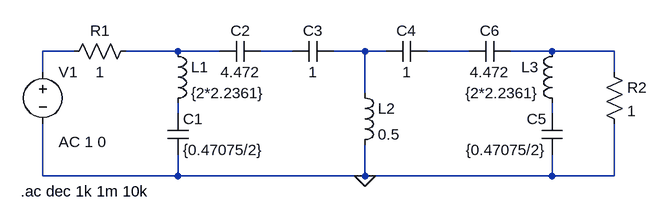
[diagram p0: schematic ej8.asc]
ej8.asc, the LTspice schematic file:
Version 4
SHEET 1 968 680
WIRE 80 80 32 80
WIRE 240 80 160 80
WIRE 304 80 240 80
WIRE 416 80 368 80
WIRE 528 80 480 80
WIRE 560 80 528 80
WIRE 688 80 624 80
WIRE 816 80 752 80
WIRE 912 80 816 80
WIRE 32 112 32 80
WIRE 912 112 912 80
WIRE 528 144 528 80
WIRE 240 176 240 160
WIRE 816 176 816 160
WIRE 32 272 32 192
WIRE 240 272 240 240
WIRE 240 272 32 272
WIRE 528 272 528 224
WIRE 528 272 240 272
WIRE 816 272 816 240
WIRE 816 272 528 272
WIRE 912 272 912 192
WIRE 912 272 816 272
FLAG 528 272 0
SYMBOL voltage 32 96 R0
WINDOW 123 24 124 Left 2
WINDOW 39 0 0 Left 0
SYMATTR InstName V1
SYMATTR Value ""
SYMATTR Value2 AC 1 0
SYMBOL res 176 64 R90
WINDOW 0 0 56 VBottom 2
WINDOW 3 32 56 VTop 2
SYMATTR InstName R1
SYMATTR Value 1
SYMBOL ind 224 64 R0
SYMATTR InstName L1
SYMATTR Value {2*2.2361}
SYMBOL cap 224 176 R0
SYMATTR InstName C1
SYMATTR Value {0.47075/2}
SYMBOL cap 368 64 R90
WINDOW 0 0 32 VBottom 2
WINDOW 3 32 32 VTop 2
SYMATTR InstName C2
SYMATTR Value 4.472
SYMBOL cap 480 64 R90
WINDOW 0 0 32 VBottom 2
WINDOW 3 32 32 VTop 2
SYMATTR InstName C3
SYMATTR Value 1
SYMBOL cap 624 64 R90
WINDOW 0 0 32 VBottom 2
WINDOW 3 32 32 VTop 2
SYMATTR InstName C4
SYMATTR Value 1
SYMBOL ind 512 128 R0
SYMATTR InstName L2
SYMATTR Value 0.5
SYMBOL ind 832 64 M0
SYMATTR InstName L3
SYMATTR Value {2*2.2361}
SYMBOL cap 832 176 M0
SYMATTR InstName C5
SYMATTR Value {0.47075/2}
SYMBOL cap 688 64 M90
WINDOW 0 0 32 VBottom 2
WINDOW 3 32 32 VTop 2
SYMATTR InstName C6
SYMATTR Value 4.472
SYMBOL res 896 96 R0
SYMATTR InstName R2
SYMATTR Value 1
TEXT -2 296 Left 2 !.ac dec 1k 1m 10k

The netlist it stands for:
* ej8.asc
V1 N001 0 AC 1 0
R1 N002 N001 1
L1 N002 N007 {2*2.2361}
C1 N007 0 {0.47075/2}
C2 N003 N002 4.472
C3 N004 N003 1
C4 N005 N004 1
L2 N004 0 0.5
L3 N006 N008 {2*2.2361}
C5 N008 0 {0.47075/2}
C6 N005 N006 4.472
R2 N006 0 1
.ac dec 1k 1m 10k
.backanno
.end